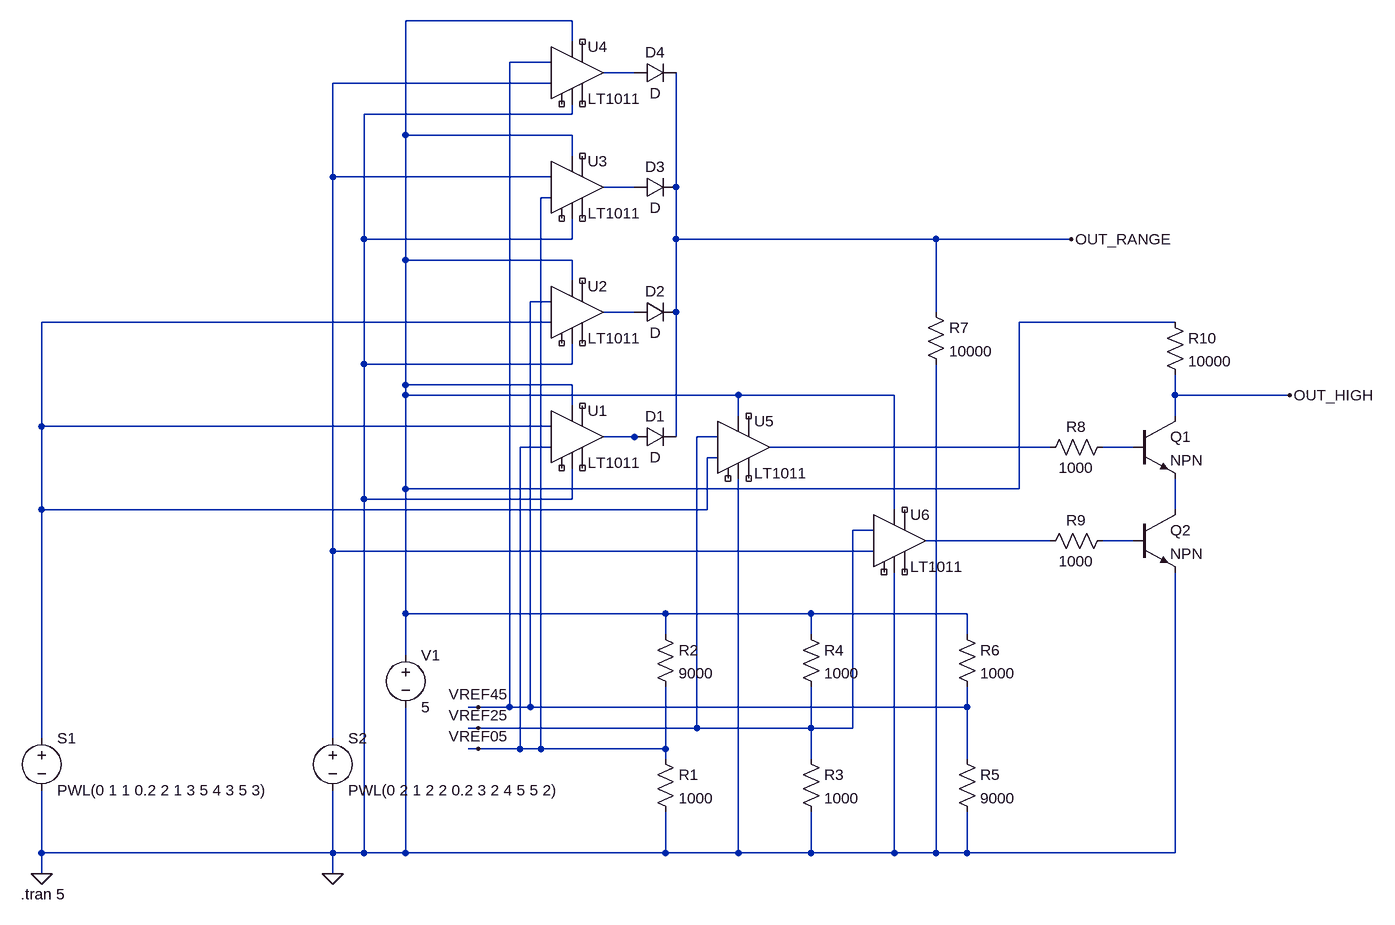
[diagram p0: schematic f1flopaednjk.asc]
f1flopaednjk.asc, the LTspice schematic file:
Version 4.1
SHEET 1 1608 680
WIRE 352 -1344 96 -1344
WIRE 352 -1312 352 -1344
WIRE 320 -1280 256 -1280
WIRE 448 -1264 400 -1264
WIRE 320 -1248 -16 -1248
WIRE 352 -1200 352 -1216
WIRE 352 -1200 32 -1200
WIRE 96 -1168 96 -1344
WIRE 352 -1168 96 -1168
WIRE 352 -1136 352 -1168
WIRE -16 -1104 -16 -1248
WIRE 320 -1104 -16 -1104
WIRE 448 -1088 400 -1088
WIRE 512 -1088 512 -1264
WIRE 320 -1072 304 -1072
WIRE 32 -1008 32 -1200
WIRE 352 -1008 352 -1040
WIRE 352 -1008 32 -1008
WIRE 512 -1008 512 -1088
WIRE 912 -1008 512 -1008
WIRE 1120 -1008 912 -1008
WIRE 96 -976 96 -1168
WIRE 352 -976 96 -976
WIRE 352 -944 352 -976
WIRE 320 -912 288 -912
WIRE 448 -896 400 -896
WIRE 512 -896 512 -1008
WIRE 912 -896 912 -1008
WIRE 320 -880 -464 -880
WIRE 1280 -880 1040 -880
WIRE 32 -816 32 -1008
WIRE 352 -816 352 -848
WIRE 352 -816 32 -816
WIRE 96 -784 96 -976
WIRE 352 -784 96 -784
WIRE 96 -768 96 -784
WIRE 608 -768 96 -768
WIRE 848 -768 608 -768
WIRE 1280 -768 1280 -800
WIRE 1456 -768 1280 -768
WIRE 352 -752 352 -784
WIRE 608 -736 608 -768
WIRE 1280 -736 1280 -768
WIRE -464 -720 -464 -880
WIRE 320 -720 -464 -720
WIRE 448 -704 400 -704
WIRE 464 -704 448 -704
WIRE 512 -704 512 -896
WIRE 576 -704 544 -704
WIRE 320 -688 272 -688
WIRE 1088 -688 656 -688
WIRE 1216 -688 1168 -688
WIRE 576 -672 560 -672
WIRE 96 -624 96 -768
WIRE 1040 -624 1040 -880
WIRE 1040 -624 96 -624
WIRE 32 -608 32 -816
WIRE 352 -608 352 -656
WIRE 352 -608 32 -608
WIRE -464 -592 -464 -720
WIRE 560 -592 560 -672
WIRE 560 -592 -464 -592
WIRE 848 -592 848 -768
WIRE 1280 -592 1280 -640
WIRE 816 -560 784 -560
WIRE 1088 -544 896 -544
WIRE 1216 -544 1168 -544
WIRE -16 -528 -16 -1104
WIRE 816 -528 -16 -528
WIRE 96 -432 96 -624
WIRE 496 -432 96 -432
WIRE 720 -432 496 -432
WIRE 960 -432 720 -432
WIRE 496 -400 496 -432
WIRE 720 -400 720 -432
WIRE 960 -400 960 -432
WIRE 96 -368 96 -432
WIRE 208 -288 192 -288
WIRE 256 -288 256 -1280
WIRE 256 -288 208 -288
WIRE 288 -288 288 -912
WIRE 288 -288 256 -288
WIRE 960 -288 960 -320
WIRE 960 -288 288 -288
WIRE 208 -256 192 -256
WIRE 544 -256 544 -704
WIRE 544 -256 208 -256
WIRE 720 -256 720 -320
WIRE 720 -256 544 -256
WIRE 784 -256 784 -560
WIRE 784 -256 720 -256
WIRE -464 -240 -464 -592
WIRE -16 -240 -16 -528
WIRE 208 -224 192 -224
WIRE 272 -224 272 -688
WIRE 272 -224 208 -224
WIRE 304 -224 304 -1072
WIRE 304 -224 272 -224
WIRE 496 -224 496 -320
WIRE 496 -224 304 -224
WIRE 496 -208 496 -224
WIRE 720 -208 720 -256
WIRE 960 -208 960 -288
WIRE -464 -64 -464 -160
WIRE -16 -64 -16 -160
WIRE -16 -64 -464 -64
WIRE 32 -64 32 -608
WIRE 32 -64 -16 -64
WIRE 96 -64 96 -288
WIRE 96 -64 32 -64
WIRE 496 -64 496 -128
WIRE 496 -64 96 -64
WIRE 608 -64 608 -640
WIRE 608 -64 496 -64
WIRE 720 -64 720 -128
WIRE 720 -64 608 -64
WIRE 848 -64 848 -496
WIRE 848 -64 720 -64
WIRE 912 -64 912 -816
WIRE 912 -64 848 -64
WIRE 960 -64 960 -128
WIRE 960 -64 912 -64
WIRE 1280 -64 1280 -496
WIRE 1280 -64 960 -64
WIRE -464 -32 -464 -64
WIRE -16 -32 -16 -64
FLAG -464 -32 0
FLAG -16 -32 0
FLAG 208 -224 VREF05
FLAG 208 -256 VREF25
FLAG 208 -288 VREF45
FLAG 1120 -1008 OUT_RANGE
FLAG 1456 -768 OUT_HIGH
SYMBOL voltage -464 -256 R0
WINDOW 123 0 0 Left 0
WINDOW 39 0 0 Left 0
SYMATTR InstName S1
SYMATTR Value PWL(0 1 1 0.2 2 1 3 5 4 3 5 3)
SYMBOL voltage -16 -256 R0
WINDOW 123 0 0 Left 0
WINDOW 39 0 0 Left 0
SYMATTR InstName S2
SYMATTR Value PWL(0 2 1 2 2 0.2 3 2 4 5 5 2)
SYMBOL voltage 96 -384 R0
WINDOW 123 0 0 Left 0
WINDOW 39 0 0 Left 0
SYMATTR InstName V1
SYMATTR Value 5
SYMBOL res 480 -224 R0
SYMATTR InstName R1
SYMATTR Value 1000
SYMBOL res 480 -416 R0
SYMATTR InstName R2
SYMATTR Value 9000
SYMBOL res 704 -224 R0
SYMATTR InstName R3
SYMATTR Value 1000
SYMBOL res 704 -416 R0
SYMATTR InstName R4
SYMATTR Value 1000
SYMBOL res 944 -224 R0
SYMATTR InstName R5
SYMATTR Value 9000
SYMBOL res 944 -416 R0
SYMATTR InstName R6
SYMATTR Value 1000
SYMBOL Comparators\\LT1011 352 -704 R0
SYMATTR InstName U1
SYMBOL Comparators\\LT1011 352 -896 R0
SYMATTR InstName U2
SYMBOL Comparators\\LT1011 352 -1088 R0
SYMATTR InstName U3
SYMBOL Comparators\\LT1011 352 -1264 R0
SYMATTR InstName U4
SYMBOL Comparators\\LT1011 608 -688 R0
SYMATTR InstName U5
SYMBOL Comparators\\LT1011 848 -544 R0
SYMATTR InstName U6
SYMBOL diode 448 -688 R270
WINDOW 0 32 32 VTop 2
WINDOW 3 0 32 VBottom 2
SYMATTR InstName D1
SYMBOL diode 448 -880 R270
WINDOW 0 32 32 VTop 2
WINDOW 3 0 32 VBottom 2
SYMATTR InstName D2
SYMBOL diode 448 -1072 R270
WINDOW 0 32 32 VTop 2
WINDOW 3 0 32 VBottom 2
SYMATTR InstName D3
SYMBOL diode 448 -1248 R270
WINDOW 0 32 32 VTop 2
WINDOW 3 0 32 VBottom 2
SYMATTR InstName D4
SYMBOL res 896 -912 R0
SYMATTR InstName R7
SYMATTR Value 10000
SYMBOL npn 1216 -736 R0
SYMATTR InstName Q1
SYMBOL npn 1216 -592 R0
SYMATTR InstName Q2
SYMBOL res 1184 -704 R90
WINDOW 0 0 56 VBottom 2
WINDOW 3 32 56 VTop 2
SYMATTR InstName R8
SYMATTR Value 1000
SYMBOL res 1184 -560 R90
WINDOW 0 0 56 VBottom 2
WINDOW 3 32 56 VTop 2
SYMATTR InstName R9
SYMATTR Value 1000
SYMBOL res 1264 -896 R0
SYMATTR InstName R10
SYMATTR Value 10000
TEXT -496 0 Left 2 !.tran 5

The netlist it stands for:
* f1flopaednjk.asc
V§S1 N006 0 PWL(0 1 1 0.2 2 1 3 5 4 3 5 3)
V§S2 N003 0 PWL(0 2 1 2 2 0.2 3 2 4 5 5 2)
V1 N001 0 5
R1 VREF05 0 1000
R2 N001 VREF05 9000
R3 VREF25 0 1000
R4 N001 VREF25 1000
R5 VREF45 0 9000
R6 N001 VREF45 1000
X§U1 NC_01 VREF05 N006 0 NC_02 NC_03 N007 N001 LT1011
X§U2 NC_04 N006 VREF45 0 NC_05 NC_06 N005 N001 LT1011
X§U3 NC_07 VREF05 N003 0 NC_08 NC_09 N004 N001 LT1011
X§U4 NC_10 N003 VREF45 0 NC_11 NC_12 N002 N001 LT1011
X§U5 NC_13 N006 VREF25 0 NC_14 NC_15 N008 N001 LT1011
X§U6 NC_16 N003 VREF25 0 NC_17 NC_18 N011 N001 LT1011
D1 N007 OUT_RANGE D
D2 N005 OUT_RANGE D
D3 N004 OUT_RANGE D
D4 N002 OUT_RANGE D
R7 OUT_RANGE 0 10000
Q1 OUT_HIGH N009 N010 0 NPN
Q2 N010 N012 0 0 NPN
R8 N009 N008 1000
R9 N012 N011 1000
R10 N001 OUT_HIGH 10000
.model D D
.lib standard.dio
.model NPN NPN
.model PNP PNP
.lib standard.bjt
.tran 5
.lib LTC1.lib
.backanno
.end